# EAGLE design seleprom6-7 (EAGLE 8.3.1)
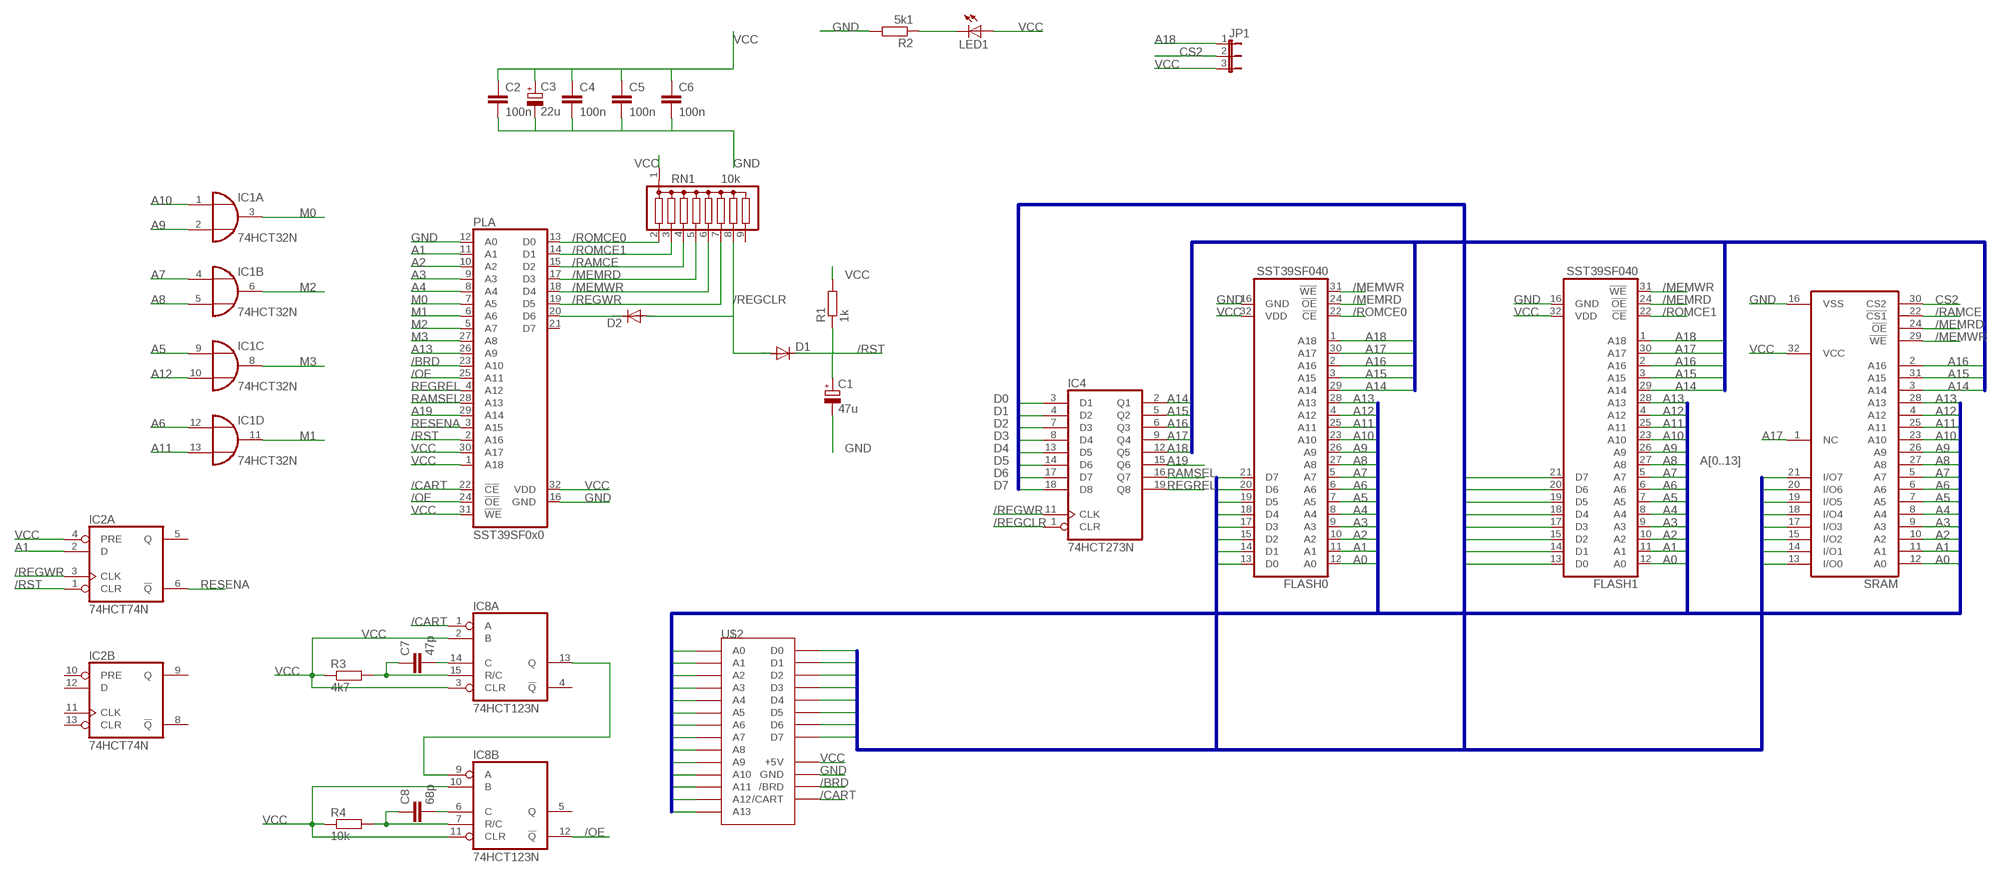
[diagram p0: schematic, sheet 1]

## Parts
C1  47u  CPOL-EUE2.5-5  [E2,5-5]
C2  100n  C-EU025-025X050  [C025-025X050]
C3  22u  CPOL-EUE2-4  [E2-4]
C4  100n  C-EU025-025X050  [C025-025X050]
C5  100n  C-EU025-025X050  [C025-025X050]
C6  100n  C-EU025-025X050  [C025-025X050]
C7  47p  C-EU025-025X050  [C025-025X050]
C8  68p  C-EU025-025X050  [C025-025X050]
D1  DIODE-D-5  [D-5]
D2  DIODE-D-5  [D-5]
FLASH0  SST39SF040  SST39F040  [PLCC-SR32]
FLASH1  SST39SF040  SST39F040  [PLCC-SR32]
IC1  74HCT32N  [DIL14]
IC2  74HCT74N  [DIL14]
IC4  74HCT273N  74273N  [DIL20]
IC8  74HCT123N  74LS123N  [DIL16]
JP1  JP2E  [JP2]
LED1  LED3MM  [LED3MM]
PLA  SST39SF0x0  SST39F040  [PLCC-SR32]
R1  1k  R-EU_0204/7  [0204/7]
R2  5k1  R-EU_0204/7  [0204/7]
R3  4k7  R-EU_0204/7  [0204/7]
R4  10k  R-EU_0204/7  [0204/7]
RN1  10k  G08R  [SIL9]
SRAM  628128P  [DIL32]
U$2  TVC-CARD+  [TVC-CART-CARD]

## Nets
/BRD: PLA.23(A10) U$2.BTM24(/BRD)
/CART: IC8.1(A:A) PLA.22(!CE) U$2.BTM23(/CART)
/MEMRD: FLASH0.24(!OE) FLASH1.24(!OE) PLA.17(D3) RN1.5 SRAM.24(!OE)
/MEMWR: FLASH0.31(!WE) FLASH1.31(!WE) PLA.18(D4) RN1.6 SRAM.29(!WE)
/OE: IC8.12(B:!Q) PLA.24(!OE) PLA.25(A11)
/RAMCE: PLA.15(D2) RN1.4 SRAM.22(!CS1)
/REGCLR: D1.A D2.A IC4.1(CLR) RN1.8
/REGWR: IC2.3(A:CLK) IC4.11(CLK) PLA.19(D5) RN1.7
/ROMCE0: FLASH0.22(!CE) PLA.13(D0) RN1.2
/ROMCE1: FLASH1.22(!CE) PLA.14(D1) RN1.3
/RST: C1.+ D1.C IC2.1(A:CLR) PLA.2(A16) R1.1
A0: FLASH0.12(A0) FLASH1.12(A0) SRAM.12(A0) U$2.TOP25(A0)
A1: FLASH0.11(A1) FLASH1.11(A1) IC2.2(A:D) PLA.11(A1) SRAM.11(A1) U$2.TOP2(A1)
A2: FLASH0.10(A2) FLASH1.10(A2) PLA.10(A2) SRAM.10(A2) U$2.TOP24(A2)
A3: FLASH0.9(A3) FLASH1.9(A3) PLA.9(A3) SRAM.9(A3) U$2.TOP1(A3)
A4: FLASH0.8(A4) FLASH1.8(A4) PLA.8(A4) SRAM.8(A4) U$2.TOP21(A4)
A5: FLASH0.7(A5) FLASH1.7(A5) IC1.9(C:I0) SRAM.7(A5) U$2.TOP14(A5)
A6: FLASH0.6(A6) FLASH1.6(A6) IC1.12(D:I0) SRAM.6(A6) U$2.TOP18(A6)
A7: FLASH0.5(A7) FLASH1.5(A7) IC1.4(B:I0) SRAM.5(A7) U$2.TOP17(A7)
A8: FLASH0.27(A8) FLASH1.27(A8) IC1.5(B:I1) SRAM.27(A8) U$2.TOP15(A8)
A9: FLASH0.26(A9) FLASH1.26(A9) IC1.2(A:I1) SRAM.26(A9) U$2.TOP19(A9)
A10: FLASH0.23(A10) FLASH1.23(A10) IC1.1(A:I0) SRAM.23(A10) U$2.TOP22(A10)
A11: FLASH0.25(A11) FLASH1.25(A11) IC1.13(D:I1) SRAM.25(A11) U$2.TOP20(A11)
A12: FLASH0.4(A12) FLASH1.4(A12) IC1.10(C:I1) SRAM.4(A12) U$2.TOP16(A12)
A13: FLASH0.28(A13) FLASH1.28(A13) PLA.26(A9) SRAM.28(A13) U$2.TOP23(A13)
A14: FLASH0.29(A14) FLASH1.29(A14) IC4.2(Q1) SRAM.3(A14)
A15: FLASH0.3(A15) FLASH1.3(A15) IC4.5(Q2) SRAM.31(A15)
A16: FLASH0.2(A16) FLASH1.2(A16) IC4.6(Q3) SRAM.2(A16)
A17: FLASH0.30(A17) FLASH1.30(A17) IC4.9(Q4) SRAM.1(NC)
A18: FLASH0.1(A18) FLASH1.1(A18) IC4.12(Q5) JP1.1
A19: IC4.15(Q6) PLA.29(A14)
CS2: JP1.2 SRAM.30(CS2)
D0: FLASH0.13(D0) FLASH1.13(D0) IC4.3(D1) SRAM.13(I/O0) U$2.TOP4(D0)
D1: FLASH0.14(D1) FLASH1.14(D1) IC4.4(D2) SRAM.14(I/O1) U$2.TOP5(D1)
D2: FLASH0.15(D2) FLASH1.15(D2) IC4.7(D3) SRAM.15(I/O2) U$2.TOP6(D2)
D3: FLASH0.17(D3) FLASH1.17(D3) IC4.8(D4) SRAM.17(I/O3) U$2.TOP7(D3)
D4: FLASH0.18(D4) FLASH1.18(D4) IC4.13(D5) SRAM.18(I/O4) U$2.TOP8(D4)
D5: FLASH0.19(D5) FLASH1.19(D5) IC4.14(D6) SRAM.19(I/O5) U$2.TOP9(D5)
D6: FLASH0.20(D6) FLASH1.20(D6) IC4.17(D7) SRAM.20(I/O6) U$2.TOP10(D6)
D7: FLASH0.21(D7) FLASH1.21(D7) IC4.18(D8) SRAM.21(I/O7) U$2.TOP3(D7)
GND [power]: C1.- C2.2 C3.- C4.2 C5.2 C6.2 FLASH0.16(GND) FLASH1.16(GND) PLA.12(A0) PLA.16(GND) R2.2 SRAM.16(VSS) U$2.BTM1(GND) U$2.BTM2(GND) U$2.BTM3(GND) U$2.BTM4(GND) U$2.BTM5(GND) U$2.BTM6(GND) U$2.BTM7(GND) U$2.BTM8(GND)
M0: IC1.3(A:O) PLA.7(A5)
M1: IC1.11(D:O) PLA.6(A6)
M2: IC1.6(B:O) PLA.5(A7)
M3: IC1.8(C:O) PLA.27(A8)
N$1: D2.C PLA.20(D6)
N$3: LED1.K(C) R2.1
N$6: IC8.9(B:A) IC8.13(A:Q)
N$7: C7.2 IC8.14(A:C)
N$8: C8.2 IC8.6(B:C)
N$9: C8.1 IC8.7(B:R/C) R4.2
N$11: C7.1 IC8.15(A:R/C) R3.2
RAMSEL: IC4.16(Q7) PLA.28(A13)
REGREL: IC4.19(Q8) PLA.4(A12)
RESENA: IC2.6(A:!Q) PLA.3(A15)
VCC [power]: C2.1 C3.+ C4.1 C5.1 C6.1 FLASH0.32(VDD) FLASH1.32(VDD) IC2.4(A:PRE) IC8.2(A:B) IC8.3(A:CLR) IC8.10(B:B) IC8.11(B:CLR) JP1.3 LED1.A PLA.1(A18) PLA.30(A17) PLA.31(!WE) PLA.32(VDD) R1.2 R3.1 R4.1 RN1.1 SRAM.32(VCC) U$2.BTM10(+5V) U$2.BTM11(+5V) U$2.BTM12(+5V) U$2.BTM13(+5V) U$2.BTM14(+5V) U$2.BTM15(+5V) U$2.BTM16(+5V) U$2.BTM17(+5V)
Unconnected: IC2.5(A:Q) IC2.8(B:!Q) IC2.9(B:Q) IC2.10(B:PRE) IC2.11(B:CLK) IC2.12(B:D) IC2.13(B:CLR) IC8.4(A:!Q) IC8.5(B:Q) PLA.21(D7) RN1.9

## Buses
A[0..13]
A[14..18]
D[0..7]

## Power pins joined to a net without a drawn wire
GND: IC1.7(P:GND) IC2.7(P:GND) IC4.10(GND) IC8.8(P:GND)
VCC: IC1.14(P:VCC) IC2.14(P:VCC) IC4.20(VCC) IC8.16(P:VCC)

## Library data of the parts
C1 C3 = rcl:CPOL-EU: POLARIZED CAPACITOR, European symbol
C2 C4-C8 = rcl:C-EU: CAPACITOR, European symbol
D1 D2 = diode:DIODE-: DIODE
FLASH0 FLASH1 PLA = sst39f040:SST39F040
IC1 = 74xx-eu:74*32: Quad 2-input OR gate
IC2 = 74xx-eu:74*74: Dual D type positive edge triggered FLIP FLOP, preset and clear
IC4 = 74xx-eu:74*273: Octal D type FLIP FLOP, clear
IC8 = 74xx-eu:74*123: Retriggerable monostable MULTIVIBRATOR
JP1 = jumper:JP2E: JUMPER
LED1 = led:LED: LED OSRAM: - CHIPLED LG R971, LG N971, LY N971, LG Q971, LY Q971, LO R971, LY R971 LH N974, LH R974 LS Q976, LO Q976, LY Q976 LO Q996 - Hyper CHIPLED LW Q18S LB Q993, LB Q99A, LB R99A - SideLED LS A670, LO A670, LY A670, LG A670, LP A670 LB A673, LV A673, LT A673, LW A673 LH A674 LY A675 LS A676, LA A676, LO A676, LY A676, LW A676 LS A679, LY A679, LG A679 - Hyper Micro SIDELED® LS Y876, LA Y876, LO Y876, LY Y876 LT Y87S - SmartLED LW L88C, LW L88S LB L89C, LB L89S, LG L890 LS L89K, LO L89K, LY L89K LS L896, LA L896, LO L896, LY L896 - TOPLED LS T670, LO T670, LY T670, LG T670, LP T670 LSG T670, LSP T670, LSY T670, LOP T670, LYG T670 LG T671, LOG T671, LSG T671 LB T673, LV T673, LT T673, LW T673 LH T674 LS T676, LA T676, LO T676, LY T676, LB T676, LH T676, LSB T676, LW T676 LB T67C, LV T67C, LT T67C, LS T67K, LO T67K, LY T67K, LW E67C LS E67B, LA E67B, LO E67B, LY E67B, LB E67C, LV E67C, LT E67C LW T67C LS T679, LY T679, LG T679 LS T770, LO T770, LY T770, LG T770, LP T770 LB T773, LV T773, LT T773, LW T773 LH T774 LS E675, LA E675, LY E675, LS T675 LS T776, LA T776, LO T776, LY T776, LB T776 LHGB T686 LT T68C, LB T68C - Hyper Mini TOPLED® LB M676 - Mini TOPLED Santana® LG M470 LS M47K, LO M47K, LY M47K Source: http://www.osram.convergy.de LUXEON: - LUMILED® LXK2-PW12-R00, LXK2-PW12-S00, LXK2-PW14-U00, LXK2-PW14-V00 LXK2-PM12-R00, LXK2-PM12-S00, LXK2-PM14-U00 LXK2-PE12-Q00, LXK2-PE12-R00, LXK2-PE12-S00, LXK2-PE14-T00, LXK2-PE14-U00 LXK2-PB12-K00, LXK2-PB12-L00, LXK2-PB12-M00, LXK2-PB14-N00, LXK2-PB14-P00, LXK2-PB14-Q00 LXK2-PR12-L00, LXK2-PR12-M00, LXK2-PR14-Q00, LXK2-PR14-R00 LXK2-PD12-Q00, LXK2-PD12-R00, LXK2-PD12-S00 LXK2-PH12-R00, LXK2-PH12-S00 LXK2-PL12-P00, LXK2-PL12-Q00, LXK2-PL12-R00 Source: www.luxeon.com KINGBRIGHT: KA-3528ASYC Source: www.kingbright.com
R1-R4 = rcl:R-EU_: RESISTOR, European symbol
RN1 = resistor-sil:G08R: SIL RESISTOR; OC_FARNELL: unknown; OC_NEWARK: unknown
SRAM = memory-hitachi:628128P: MEMORY; OC_FARNELL: unknown; OC_NEWARK: unknown
U$2 = tvc-cart:TVC-CARD+

## Net classes
0 default: width 0.254 mm
1 power: width 0.356 mm

## Board
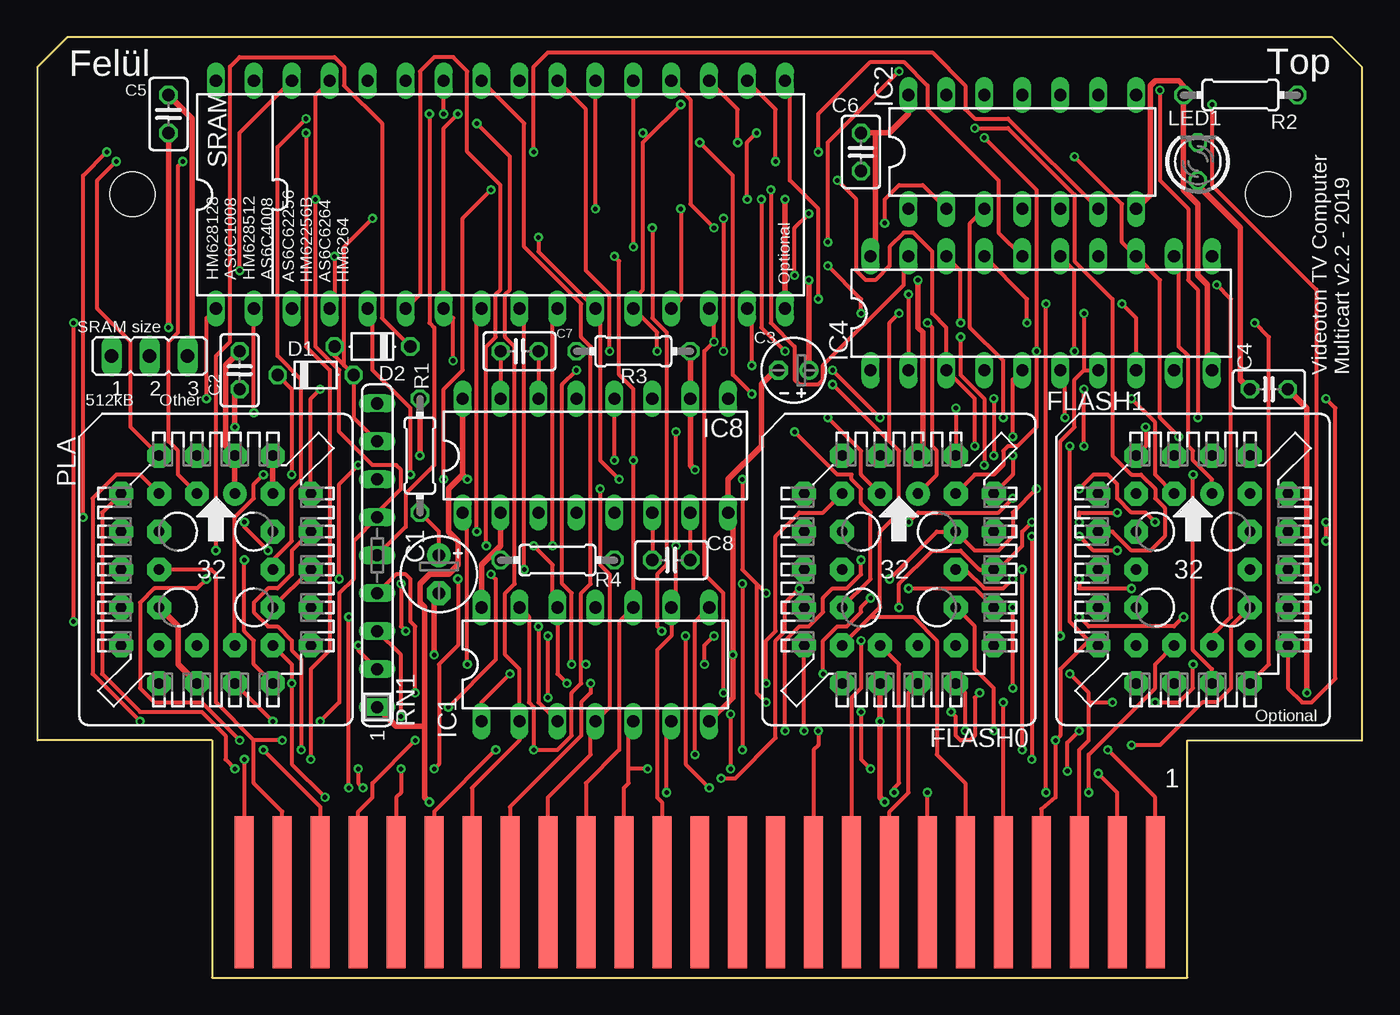
[diagram p1: board, top side]
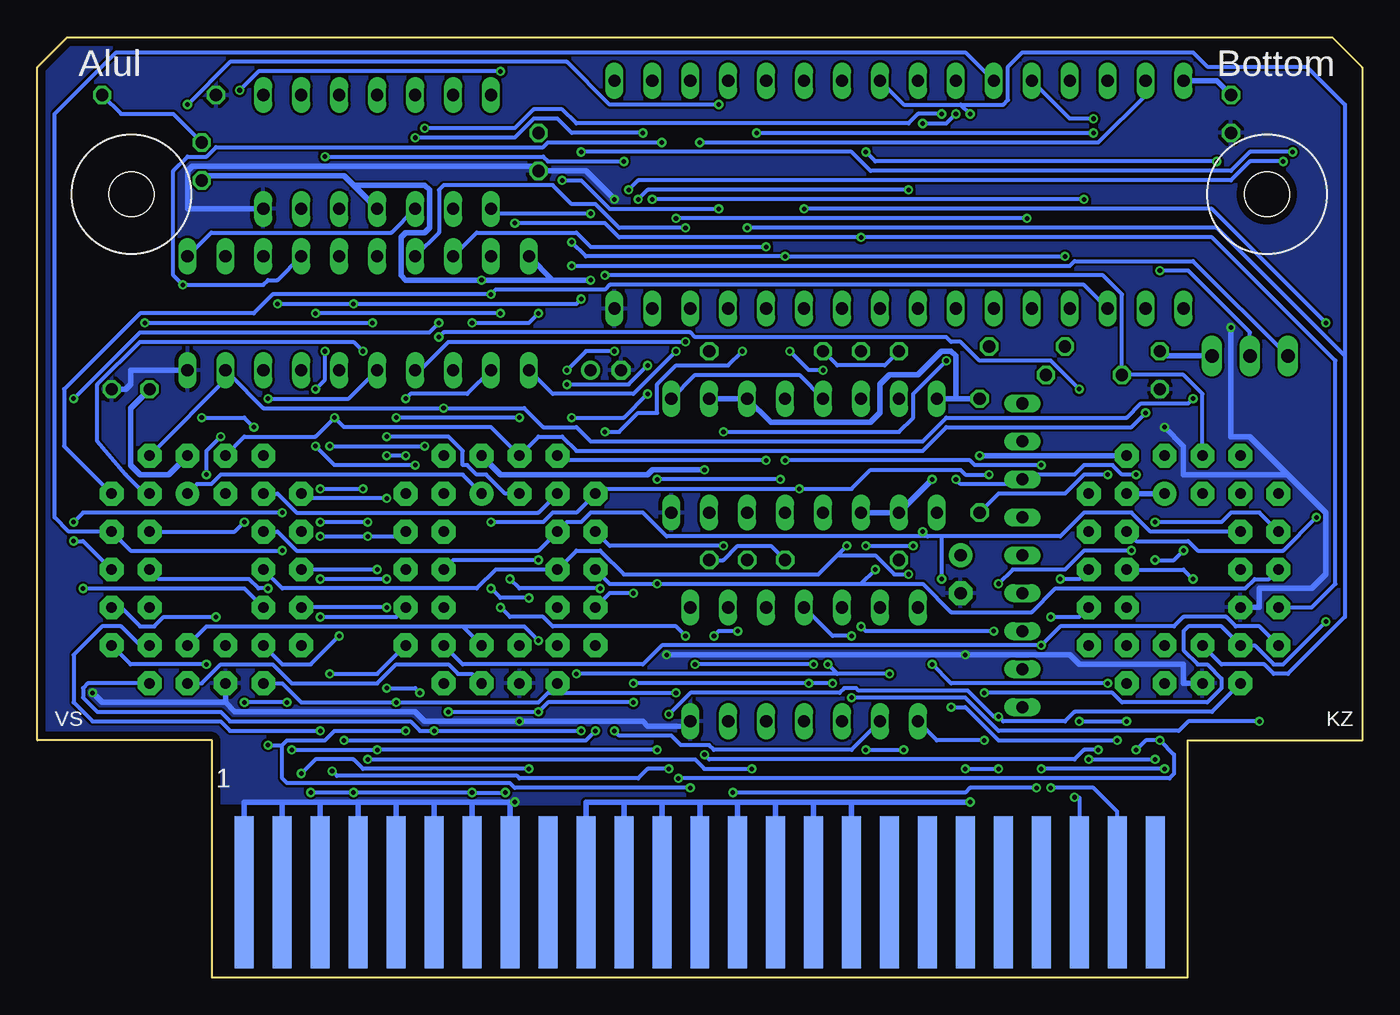
[diagram p2: board, bottom side, seen from below]

Size 88.68 x 62.91 mm. Coordinates in mm from the lower left corner, seen from the top.
Copper layers (1*16): Top 0.035mm / dielectric 1.6mm / Bottom 0.035mm
Design rules "Elecrow_2-layer_PCB_eagle_rule": minimum track width 6mil, minimum drill 12mil, track to track 6mil, track to pad 6mil, pad to pad 6mil, via to via 8mil, smd to smd 0mil, copper to edge 20mil, drill to drill 10mil, minimum pad ring 6mil, minimum via ring 6mil, stop-mask expansion 0mil, vias tented up to drill 100mil, thermal gap 10mil

### Footprints (pad centres in the part's own frame; a part is rotated, then mirrored left to right if it is on the bottom)
E2,5-5 = drill 0.813 pad 1.6: + -1.27,0 | drill 0.813 pad 1.6 octagon: - 1.27,0
C025-025X050 = drill 0.813 octagon: 1 -1.27,0; 2 1.27,0
E2-4 = drill 0.813 pad 1.27: + -1.016,0 | drill 0.813 pad 1.27 octagon: - 1.016,0
D-5 = drill 0.813 octagon: A 2.54,0; C -2.54,0
PLCC-SR32 = drill 0.7 pad 1.6: 1 1.27,5.08 | drill 0.7 pad 1.6 octagon: 2 -1.27,7.62; 3 -1.27,5.08; 4 -3.81,7.62; 5 -6.35,5.08; 6 -3.81,5.08; 7 -6.35,2.54; 8 -3.81,2.54; 9 -6.35,0; 10 -3.81,0; 11 -6.35,-2.54; 12 -3.81,-2.54; 13 -6.35,-5.08; 14 -3.81,-7.62; 15 -3.81,-5.08; 16 -1.27,-7.62; 17 -1.27,-5.08; 18 1.27,-7.62; 19 1.27,-5.08; 20 3.81,-7.62; 21 6.35,-5.08; 22 3.81,-5.08; 23 6.35,-2.54; 24 3.81,-2.54; 25 6.35,0; 26 3.81,0; 27 6.35,2.54; 28 3.81,2.54; 29 6.35,5.08; 30 3.81,7.62; 31 3.81,5.08; 32 1.27,7.62
DIL14 = drill 0.813 long: 1 -7.62,-3.81; 2 -5.08,-3.81; 3 -2.54,-3.81; 4 0,-3.81; 5 2.54,-3.81; 6 5.08,-3.81; 7 7.62,-3.81; 8 7.62,3.81; 9 5.08,3.81; 10 2.54,3.81; 11 0,3.81; 12 -2.54,3.81; 13 -5.08,3.81; 14 -7.62,3.81
DIL20 = drill 0.813 long: 1 -11.43,-3.81; 2 -8.89,-3.81; 3 -6.35,-3.81; 4 -3.81,-3.81; 5 -1.27,-3.81; 6 1.27,-3.81; 7 3.81,-3.81; 8 6.35,-3.81; 9 8.89,-3.81; 10 11.43,-3.81; 11 11.43,3.81; 12 8.89,3.81; 13 6.35,3.81; 14 3.81,3.81; 15 1.27,3.81; 16 -1.27,3.81; 17 -3.81,3.81; 18 -6.35,3.81; 19 -8.89,3.81; 20 -11.43,3.81
DIL16 = drill 0.813 long: 1 -8.89,-3.81; 2 -6.35,-3.81; 3 -3.81,-3.81; 4 -1.27,-3.81; 5 1.27,-3.81; 6 3.81,-3.81; 7 6.35,-3.81; 8 8.89,-3.81; 9 8.89,3.81; 10 6.35,3.81; 11 3.81,3.81; 12 1.27,3.81; 13 -1.27,3.81; 14 -3.81,3.81; 15 -6.35,3.81; 16 -8.89,3.81
JP2 = drill 0.914 long: 1 -2.54,0; 2 0,0; 3 2.54,0
LED3MM = drill 0.813 octagon: A -1.27,0; K 1.27,0
0204/7 = drill 0.813 octagon: 1 -3.81,0; 2 3.81,0
SIL9 = drill 0.813 long: 1 -10.16,0; 2 -7.62,0; 3 -5.08,0; 4 -2.54,0; 5 0,0; 6 2.54,0; 7 5.08,0; 8 7.62,0; 9 10.16,0
DIL32 = drill 0.813 long: 1 -19.05,-7.62; 2 -16.51,-7.62; 3 -13.97,-7.62; 4 -11.43,-7.62; 5 -8.89,-7.62; 6 -6.35,-7.62; 7 -3.81,-7.62; 8 -1.27,-7.62; 9 1.27,-7.62; 10 3.81,-7.62; 11 6.35,-7.62; 12 8.89,-7.62; 13 11.43,-7.62; 14 13.97,-7.62; 15 16.51,-7.62; 16 19.05,-7.62; 17 19.05,7.62; 18 16.51,7.62; 19 13.97,7.62; 20 11.43,7.62; 21 8.89,7.62; 22 6.35,7.62; 23 3.81,7.62; 24 1.27,7.62; 25 -1.27,7.62; 26 -3.81,7.62; 27 -6.35,7.62; 28 -8.89,7.62; 29 -11.43,7.62; 30 -13.97,7.62; 31 -16.51,7.62; 32 -19.05,7.62
TVC-CART-CARD = smd 1.27 x 10.16 bottom: BTM1 29.21,-6.35; BTM2 26.67,-6.35; BTM3 24.13,-6.35; BTM4 21.59,-6.35; BTM5 19.05,-6.35; BTM6 16.51,-6.35; BTM7 13.97,-6.35; BTM8 11.43,-6.35; BTM9 8.89,-6.35; BTM10 6.35,-6.35; BTM11 3.81,-6.35; BTM12 1.27,-6.35; BTM13 -1.27,-6.35; BTM14 -3.81,-6.35; BTM15 -6.35,-6.35; BTM16 -8.89,-6.35; BTM17 -11.43,-6.35; BTM18 -13.97,-6.35; BTM19 -16.51,-6.35; BTM20 -19.05,-6.35; BTM21 -21.59,-6.35; BTM22 -24.13,-6.35; BTM23 -26.67,-6.35; BTM24 -29.21,-6.35; BTM25 -31.75,-6.35 | smd 1.27 x 10.16: TOP1 29.21,-6.35; TOP2 26.67,-6.35; TOP3 24.13,-6.35; TOP4 21.59,-6.35; TOP5 19.05,-6.35; TOP6 16.51,-6.35; TOP7 13.97,-6.35; TOP8 11.43,-6.35; TOP9 8.89,-6.35; TOP10 6.35,-6.35; TOP11 3.81,-6.35; TOP12 1.27,-6.35; TOP13 -1.27,-6.35; TOP14 -3.81,-6.35; TOP15 -6.35,-6.35; TOP16 -8.89,-6.35; TOP17 -11.43,-6.35; TOP18 -13.97,-6.35; TOP19 -16.51,-6.35; TOP20 -19.05,-6.35; TOP21 -21.59,-6.35; TOP22 -24.13,-6.35; TOP23 -26.67,-6.35; TOP24 -29.21,-6.35; TOP25 -31.75,-6.35 | hole 3: -39.24,40.35; 36.76,40.35

### Placement (x,y rotation side)
C1  26.88,26.99 270 top
C2  13.54,40.64 270 top
C3  50.63,40.64 180 top
C4  82.44,39.37 0 top
C5  8.78,57.78 270 top
C6  55.13,55.25 270 top
C7  32.27,41.91 0 top
C8  42.43,27.94 180 top
D1  18.62,40.32 0 top
D2  22.43,42.23 180 top
FLASH0  57.67,27.3 0 top
FLASH1  77.36,27.3 0 top
IC1  37.35,20.95 0 top
IC2  65.93,55.25 0 top
IC4  67.2,44.45 0 top
IC8  37.35,34.92 0 top
JP1  7.51,41.59 0 top
LED1  77.68,54.61 90 top
PLA  11.95,27.3 0 top
R1  25.61,34.92 90 top
R2  80.53,59.05 180 top
R3  39.89,41.91 180 top
R4  34.81,27.94 0 top
RN1  22.75,28.26 90 top
SRAM  31,52.39 0 top
U$2  45.61,12.06 0 top

### Tracks (layer width: path | path; a pad name or v marks a point on that pad's centre or on a via)
/BRD  (via drill 0.3)
  Top 0.254: v20.84,12.7 v20.84,24.13
  Bottom 0.254: PLA.23 18.94,24.13 v20.84,24.13 | v20.84,12.7 17.99,12.7 16.4,11.11 U$2.BTM24
/CART  (via drill 0.3)
  Top 0.254: IC8.1 28.78,30.8 v28.78,20.95 | PLA.22 17.03,20.95 v17.03,19.68 17.03,14.29 v19.26,12.06
  Bottom 0.254: v28.78,20.95 27.51,19.68 v17.03,19.68 | U$2.BTM23 18.94,12.06 v19.26,12.06
/MEMRD  (via drill 0.3)
  Top 0.254: FLASH0.24 62.75,23.5 62.75,20.64 64.02,19.37 v64.02,16.51 | v73.23,15.56 75.14,15.56 77.99,18.41 78.95,18.41 79.9,19.37 79.9,23.5 FLASH1.24 | RN1.5 24.65,30.16 24.65,32.39 26.56,34.29 26.56,43.5 26.24,43.81 v26.24,57.78 | v44.97,12.7 43.39,14.29 v43.39,22.86 | v41.8,23.18 41.48,23.5 41.48,26.99 42.12,27.62 42.12,43.18 41.16,44.13 v41.16,50.17
  Bottom 0.254: v73.23,15.56 72.28,15.56 | 72.28,15.56 71.96,15.88 69.42,15.88 68.79,16.51 v64.02,16.51 | 26.88,58.42 v26.24,57.78 | 26.88,58.42 30.69,58.42 SRAM.24 | PLA.17 9.41,20.95 6.56,20.95 5.92,20.32 4.97,20.32 1.16,24.13 1.16,41.59 | 1.16,41.59 1.16,58.42 3.7,60.96 10.37,60.96 11.32,61.91 22.75,61.91 23.7,60.96 23.7,58.74 24.02,58.42 26.88,58.42 | 72.28,15.56 72.28,13.34 71.96,13.02 57.04,13.02 56.72,12.7 v44.97,12.7 | v43.39,22.86 43.07,23.18 v41.8,23.18 | v41.16,50.17 9.73,50.17 1.16,41.59
/MEMWR  (via drill 0.3)
  Top 0.254: FLASH0.31 62.75,33.66 64.02,33.66 64.66,34.29 64.66,35.24 64.98,35.56 65.61,35.56 66.88,36.83 v66.88,41.91 66.88,52.7 v63.39,56.2 | SRAM.29 18.62,59.05 v18.62,52.07 18.62,42.23 20.21,40.64 20.21,36.51 22.43,34.29 24.02,34.29 24.34,33.97 24.34,32.7 22.75,31.11 RN1.6 21.16,29.21 21.16,26.67 20.21,25.72 20.21,18.41 v18.94,17.14 | v15.76,17.14 PLA.18 | v48.15,56.52 47.51,55.88 v47.51,52.07
  Bottom 0.254: v66.88,41.91 67.52,42.55 81.8,42.55 84.66,39.69 84.66,35.88 82.76,33.66 81.49,32.39 FLASH1.31 | v18.94,17.14 v15.76,17.14 | v63.39,56.2 56.72,56.2 55.45,57.47 53.86,57.47 52.91,56.52 v48.15,56.52 | v18.62,52.07 v47.51,52.07
/OE  (via drill 0.3)
  Top 0.254: v38.62,34.61 IC8.12 | v21.48,34.29 20.21,33.02 v20.21,26.67 | PLA.25 PLA.24
  Bottom 0.254: v38.62,34.61 26.24,34.61 25.92,34.29 v21.48,34.29 | v20.21,26.67 18.94,26.67 PLA.25
/RAMCE  (via drill 0.3)
  Top 0.254: RN1.4 24.02,26.99 24.65,26.99 24.97,26.67 24.97,23.81 25.29,23.5 v25.29,19.05 | v37.35,51.44 SRAM.22 | v2.43,23.81 v2.43,43.81
  Bottom 0.254: v25.29,19.05 16.72,19.05 16.08,18.41 10.37,18.41 9.41,19.37 9.41,20 10.37,20.95 11,20.95 11.95,21.91 11.95,23.18 11.64,23.5 9.41,23.5 PLA.15 7.19,22.22 5.92,20.95 5.29,20.95 v2.43,23.81 | v37.35,51.44 10.05,51.44 v2.43,43.81
/REGCLR  (via drill 0.3)
  Top 0.254: 20.53,40.96 19.89,41.59 D2.A | 20.53,40.96 D1.A 21.16,37.47 RN1.8 | v45.93,50.8 v45.93,41.91 | v22.43,50.8 20.53,48.89 20.53,40.96
  Bottom 0.254: IC4.1 54.18,39.05 48.78,39.05 v45.93,41.91 | v22.43,50.8 v45.93,50.8
/REGWR  (via drill 0.3)
  Top 0.254: v15.13,33.66 14.49,33.02 14.49,32.07 13.22,30.8 PLA.19 | IC2.3 62.44,50.48 62.44,43.5 64.66,41.28 v64.66,37.47 | v53.23,40.64 v56.4,37.47 | v50.05,41.91 48.47,43.5 v48.47,52.07 | v30.37,52.7 28.46,50.8 28.46,40.64 27.19,39.37 v27.19,33.34
  Bottom 0.254: IC2.3 64.98,49.85 77.04,49.85 IC4.11 | v15.13,33.66 16.08,33.66 16.72,34.29 18.62,34.29 19.26,33.66 22.43,33.66 RN1.7 23.07,33.02 26.88,33.02 v27.19,33.34 | v56.4,37.47 v64.66,37.47 | v53.23,40.64 51.96,41.91 v50.05,41.91 | v48.47,52.07 47.83,52.7 v30.37,52.7
/ROMCE0  (via drill 0.3)
  Top 0.254: RN1.2 21.48,21.91 v21.48,22.22
  Bottom 0.254: PLA.13 6.87,23.5 8.46,23.5 9.1,24.13 11.95,24.13 12.59,23.5 20.21,23.5 v21.48,22.22 46.88,22.22 48.15,20.95 60.21,20.95 FLASH0.22
/ROMCE1  (via drill 0.3)
  Top 0.254: RN1.3 24.34,21.59 v24.34,17.46 | v46.4,17.62 v46.4,13.97 | v68.95,13.81 68.95,15.72 v69.74,16.51
  Bottom 0.254: PLA.14 10.05,17.78 19.26,17.78 19.89,17.14 24.02,17.14 v24.34,17.46 24.65,17.46 26.4,19.21 33.7,19.21 33.86,19.37 34.66,19.37 34.97,19.05 44.97,19.05 v46.4,17.62 | FLASH1.22 81.8,22.22 83.07,23.5 84.34,23.5 86.25,21.59 86.25,18.41 84.98,17.14 76.41,17.14 75.77,16.51 v69.74,16.51 | v46.4,13.97 47.83,13.97 48.47,13.34 56.4,13.34 56.56,13.49 68.63,13.49 v68.95,13.81
/RST  (via drill 0.3)
  Top 0.254: R1.1 26.88,29.85 C1.+ | v51.64,51.12 50.69,50.17 v50.69,46.99 | v17.03,33.66 17.03,39.37 D1.C
  Bottom 0.254: PLA.2 10.68,39.05 11.95,40.32 D1.C 16.08,45.72 17.35,46.99 v50.69,46.99 | IC2.1 57.99,51.12 v51.64,51.12 | R1.1 24.34,32.39 19.89,32.39 18.62,33.66 v17.03,33.66
A0  (via drill 0.3)
  Top 0.254: v41.48,41.91 41.48,43.18 SRAM.12 39.89,45.4 40.53,46.04 40.53,55.88 40.85,56.2 | v50.69,36.51 53.55,33.66 54.5,33.66 54.5,33.34 55.13,32.7 55.13,31.75 55.77,31.11 55.77,26.67 FLASH0.12 | v85.61,26.04 85.61,46.04 78.63,53.02 v78.63,58.42 | 40.85,56.2 v43.07,58.42 | v13.86,14.61 U$2.TOP25 | v18.3,14.61 18.3,20.64 19.57,21.91 19.57,40.64 17.99,42.23 v17.99,56.52 | 40.85,56.2 v40.53,56.52
  Bottom 0.254: v41.48,41.91 42.43,40.96 45.93,40.96 47.2,39.69 47.2,37.78 48.47,37.78 49.74,36.51 v50.69,36.51 | FLASH1.12 74.82,26.04 v85.61,26.04 | v78.63,58.42 75.77,61.28 53.23,61.28 50.37,58.42 v43.07,58.42 | v18.3,14.61 v13.86,14.61 | v40.53,56.52 v17.99,56.52
A1  (via drill 0.3)
  Top 0.254: v65.29,19.37 v65.29,24.77 | v71.01,13.65 72.28,12.38 U$2.TOP2 | v33.54,49.53 33.54,48.58 SRAM.11 37.67,44.45 37.67,34.61 v38.94,33.34 | IC2.2 59.26,53.02 57.67,53.02 56.72,52.07 v56.72,50.48 | 48.15,26.35 47.2,27.3 v47.2,33.34 | 48.15,26.35 v48.78,25.72 | v55.77,13.97 55.13,14.61 v55.13,17.78 | v48.78,18.41 48.15,19.05 48.15,26.35 | v63.07,19.05 62.75,18.73 62.75,16.19 62.44,15.88 61.8,15.88 61.48,16.19 61.48,17.46 v61.17,17.78
  Bottom 0.254: v65.29,24.77 FLASH1.11 | v71.01,13.65 70.06,14.61 67.52,14.61 66.88,13.97 v55.77,13.97 | PLA.11 3.38,24.77 1.79,26.35 1.79,41.28 10.05,49.53 v33.54,49.53 49.74,49.53 50.69,50.48 v56.72,50.48 | FLASH0.11 50.37,25.72 v48.78,25.72 | v38.94,33.34 v47.2,33.34 | v48.78,18.41 54.5,18.41 v55.13,17.78 v61.17,17.78 | v65.29,19.37 63.39,19.37 v63.07,19.05
A2  (via drill 0.3)
  Top 0.254: PLA.10 11.64,27.3 11.95,26.99 11.95,18.41 14.49,15.88 | 14.49,15.88 14.49,13.02 16.4,11.11 U$2.TOP24 | SRAM.10 34.5,44.45 v34.5,28.89 | v16.4,15.88 14.49,15.88 | v27.51,18.1 30.69,21.27 30.69,26.67 v30.37,26.99
  Bottom 0.254: 35.13,28.26 36.4,26.99 49.42,26.99 51.01,28.57 52.59,28.57 FLASH0.10 57.99,27.3 59.26,26.04 72.28,26.04 FLASH1.10 | 35.13,28.26 v34.5,28.89 | v16.4,15.88 24.34,15.88 26.56,18.1 v27.51,18.1 | v30.37,26.99 31.32,26.99 32.59,28.26 35.13,28.26
A3  (via drill 0.3)
  Top 0.254: v65.93,15.24 v65.93,27.3 | v71.64,15.24 74.82,12.06 U$2.TOP1 | SRAM.9 32.59,44.45 v32.59,27.3 | v47.2,26.35 v47.2,15.24
  Bottom 0.254: v65.93,27.3 FLASH1.9 | v71.64,15.24 v65.93,15.24 v47.2,15.24 | 33.54,26.35 v32.59,27.3 | 33.54,26.35 v47.2,26.35 50.37,26.35 FLASH0.9 | PLA.9 6.24,26.67 7.19,26.67 7.83,26.04 20.53,26.04 22.11,24.45 27.51,24.45 29.42,26.35 33.54,26.35
A4  (via drill 0.3)
  Top 0.254: SRAM.8 29.42,44.45 v29.42,29.85 | U$2.TOP21 24.34,6.03 24.02,9.84 24.02,12.06 24.34,12.38 v24.34,13.97 | v26.56,13.97 26.88,14.29 26.88,20.95 28.15,22.22 v28.15,26.67
  Bottom 0.254: FLASH1.8 72.6,29.85 71.33,28.57 55.13,28.57 FLASH0.8 53.23,30.48 52.28,30.48 51.64,31.11 48.15,31.11 46.56,29.53 29.1,29.53 | 29.1,29.53 v29.42,29.85 | 28.15,29.53 20.21,29.53 18.62,31.11 15.45,31.11 14.18,29.85 PLA.8 | 28.15,29.53 29.1,29.53 | v26.56,13.97 v24.34,13.97 | 28.15,29.53 v28.15,26.67
A5  (via drill 0.3)
  Top 0.254: v27.83,41.28 27.83,44.13 SRAM.7 27.19,56.83 v28.15,57.78 | v42.75,36.51 v42.75,28.89 42.75,25.08 IC1.9 42.43,22.86 41.48,21.91 41.48,12.06 41.8,11.75 41.8,10.48 41.48,6.03 U$2.TOP14 | FLASH1.7 71.96,29.85 73.23,28.57 74.5,28.57 75.45,29.53 75.45,31.43 74.82,32.07 74.82,32.7 73.87,33.66 73.23,33.66 71.96,34.92 71.96,45.4 69.42,47.94 69.42,52.39 64.98,56.83 v62.75,56.83
  Bottom 0.254: v27.83,41.28 30.05,39.05 30.05,37.47 31,36.51 v42.75,36.51 | FLASH0.7 50.37,28.89 v42.75,28.89 | v62.75,56.83 56.72,56.83 55.45,58.1 53.55,58.1 52.59,57.15 30.37,57.15 29.73,57.78 v28.15,57.78
A6  (via drill 0.3)
  Top 0.254: SRAM.6 25.61,45.72 25.61,60.64 26.56,61.59 27.83,61.59 28.78,60.64 28.78,55.25 31,53.02 31,46.04 30.69,45.72 30.69,42.86 30.05,42.23 v30.05,28.89 | v33.23,28.89 34.5,27.62 34.5,25.08 IC1.12 34.81,20.32 v35.45,19.68 | FLASH0.6 52.59,31.11 51.01,31.11 49.42,29.53 49.42,23.18 48.78,22.54 v48.78,19.68 | U$2.TOP18 31.96,6.03 31.64,9.84 31.64,11.43 36.4,16.19 36.4,18.41 37.04,19.05 v37.04,19.68
  Bottom 0.254: FLASH0.6 55.13,31.11 71.33,31.11 72.6,32.39 FLASH1.6 | v33.23,28.89 v30.05,28.89 | v35.45,19.68 v37.04,19.68 v48.78,19.68
A7  (via drill 0.3)
  Top 0.254: U$2.TOP17 34.18,12.06 37.04,14.92 37.04,16.83 IC1.4 38.31,18.1 38.31,26.99 37.67,27.62 v37.67,32.7 | SRAM.5 22.43,44.45 22.43,40.64 24.97,38.1 v24.97,33.66 | v65.29,32.07 64.34,31.11 58.94,31.11 v58.31,30.48
  Bottom 0.254: v24.97,33.66 26.56,33.66 26.88,33.97 32.91,33.97 34.18,32.7 v37.67,32.7 51.01,32.7 FLASH0.5 52.59,31.11 54.18,31.11 54.82,30.48 v58.31,30.48 | FLASH1.5 70.69,32.07 v65.29,32.07
A8  (via drill 0.3)
  Top 0.254: IC1.5 39.58,16.83 39.58,13.97 | 39.58,13.97 39.58,13.02 39.26,12.7 39.26,9.84 39.58,6.03 U$2.TOP15 | v69.74,29.53 70.69,28.57 v72.28,28.57 | v40.85,13.97 39.58,13.97 | v66.56,29.53 v66.56,14.61
  Bottom 0.254: SRAM.27 26.56,61.91 83.39,61.91 87.52,57.78 87.52,30.8 86.57,29.85 FLASH1.27 82.44,28.57 v72.28,28.57 | FLASH0.27 64.34,29.53 v66.56,29.53 v69.74,29.53 | v40.85,13.97 44.02,13.97 44.66,14.61 v66.56,14.61
A9  (via drill 0.3)
  Top 0.254: v27.19,57.78 SRAM.26 | v29.42,57.15 31.64,54.93 31.64,46.04 31.32,45.72 31.32,42.86 31.96,42.23 31.96,26.35 31.32,25.72 31.32,21.59 32.27,20.64 IC1.2 32.27,15.88 29.1,12.7 29.1,9.84 29.42,9.52 29.42,6.03 U$2.TOP19 | v55.13,27.94 55.13,26.99 54.18,26.04 53.23,26.04 52.59,25.4 52.59,24.45 51.64,23.5 51.01,23.5 50.05,22.54 v50.05,16.51 | v73.23,26.04 69.74,26.04 v69.74,26.67 | v65.29,26.67 64.66,26.04 63.39,26.04 62.12,27.3 FLASH0.26
  Bottom 0.254: v27.19,57.78 27.83,57.15 v29.42,57.15 | FLASH0.26 60.85,27.94 v55.13,27.94 | v50.05,16.51 49.74,16.19 46.24,16.19 45.61,15.56 43.7,15.56 43.39,15.24 34.18,15.24 IC1.2 | FLASH1.26 80.53,26.67 74.5,26.67 73.87,26.04 v73.23,26.04 | v65.29,26.67 v69.74,26.67
A10  (via drill 0.3)
  Top 0.254: v69.74,24.13 70.37,23.5 76.09,23.5 v76.72,24.13 | v25.29,15.88 22.43,13.02 22.43,12.06 21.48,11.11 U$2.TOP22 | SRAM.23 36.72,58.1 36.72,47.31 38.31,45.72 v38.31,41.91 | v36.08,40.64 35.13,39.69 35.13,26.35 35.77,25.72 v35.77,20.95 | v31.64,20.32 29.73,18.41 IC1.1 | FLASH0.23 62.75,26.04 v58.31,26.04 | v55.77,25.4 55.13,24.77 55.13,24.45 54.18,23.5 53.55,23.5 52.59,22.54 v52.59,20.32
  Bottom 0.254: FLASH0.23 64.66,24.13 v69.74,24.13 | v76.72,24.13 80.22,24.13 80.85,23.5 81.8,23.5 83.07,24.77 FLASH1.23 | IC1.1 28.46,15.88 v25.29,15.88 | v36.08,40.64 37.04,40.64 v38.31,41.91 | 35.13,20.32 v35.77,20.95 | v31.64,20.32 35.13,20.32 | v58.31,26.04 57.67,25.4 v55.77,25.4 | 35.13,20.32 v52.59,20.32
A11  (via drill 0.3)
  Top 0.254: SRAM.25 32.59,57.15 32.59,48.89 36.4,45.08 36.4,42.86 37.04,42.23 37.04,26.35 36.4,25.72 36.4,20.95 | 36.4,20.95 36.4,19.68 35.77,19.05 35.77,16.19 34.81,15.24 v33.23,15.24 33.23,18.1 32.91,18.41 32.91,24.13 IC1.13 | v57.67,24.77 57.67,26.35 59.9,28.57 61.8,28.57 63.07,27.3 FLASH0.25 64.34,27.3 65.93,28.89 65.93,29.85 v66.56,30.48 | v45.29,22.86 44.66,22.22 v44.66,20.95 | 36.4,20.95 v36.72,20.95 | v86.25,30.48 v86.25,29.21 | v72.28,31.11 69.74,31.11 v69.74,30.48 | U$2.TOP20 26.88,6.03 26.56,8.89 26.56,11.11 v30.69,15.24
  Bottom 0.254: v57.67,24.77 57.04,24.13 54.82,24.13 54.18,23.5 45.93,23.5 v45.29,22.86 | v36.72,20.95 v44.66,20.95 | FLASH1.25 85.61,29.21 v86.25,29.21 | v86.25,30.48 85.61,31.11 v72.28,31.11 | v66.56,30.48 v69.74,30.48 | v33.23,15.24 v30.69,15.24
A12  (via drill 0.3)
  Top 0.254: SRAM.4 19.89,45.08 v19.89,48.26 | v38.62,48.26 38.94,47.94 38.94,40.32 39.89,39.37 v39.89,34.61 IC1.10 38.94,23.81 38.94,15.24 36.72,13.02 36.72,9.68 37.04,6.03 U$2.TOP16 | FLASH1.4 74.18,35.56 v74.18,36.83 | v77.68,37.47 77.68,46.04 77.04,46.67 77.04,51.44 75.14,53.34 v75.14,59.37 | v57.67,60.64 52.91,55.88 v52.91,49.21
  Bottom 0.254: v19.89,48.26 v38.62,48.26 51.96,48.26 v52.91,49.21 | FLASH0.4 53.55,34.61 v39.89,34.61 | v74.18,36.83 74.82,37.47 v77.68,37.47 | v75.14,59.37 73.87,60.64 v57.67,60.64
A13  (via drill 0.3)
  Top 0.254: v66.88,32.7 65.29,31.11 65.29,29.53 64.34,28.57 62.75,28.57 FLASH0.28 60.21,29.85 v57.04,26.67 | v69.74,32.7 70.69,33.66 71.64,33.66 72.28,33.02 72.28,32.07 73.23,31.11 74.18,31.11 v74.82,30.48 | v17.99,57.47 16.08,55.56 16.08,41.59 17.67,40 17.67,33.34 17.03,32.7 17.03,29.21 15.76,27.94 PLA.26 | U$2.TOP23 18.62,6.03 18.94,9.84 18.94,11.43 v15.13,15.24 | v13.54,15.88 11,18.41 7.83,18.41 6.87,19.37 6.87,25.08 7.83,26.04 10.68,26.04 v11.32,26.67 | v51.01,26.04 50.05,25.08 50.05,23.18 49.42,22.54 49.42,16.03 46.72,13.34 v45.77,13.34
  Bottom 0.254: v69.74,32.7 v66.88,32.7 | v74.82,30.48 75.45,29.85 FLASH1.28 | SRAM.28 19.57,57.47 v17.99,57.47 | v15.13,15.24 14.49,15.88 v13.54,15.88 12.59,14.92 12.59,13.65 12.91,13.34 v45.77,13.34 | v11.32,26.67 11.95,27.3 PLA.26 | v57.04,26.67 56.4,26.04 v51.01,26.04
A14  (via drill 0.3)
  Top 0.254: v58.31,45.72 IC4.2 | FLASH0.29 65.29,33.66 v65.29,34.92 | v64.02,38.73 v64.02,34.92
  Bottom 0.254: SRAM.3 18.62,46.36 50.37,46.36 50.69,46.04 57.99,46.04 v58.31,45.72 72.91,45.72 74.18,44.45 81.8,44.45 86.88,39.37 86.88,35.56 FLASH1.29 | v64.02,34.92 v65.29,34.92 | v64.02,38.73 63.71,39.05 59.9,39.05 IC4.2
A15  (via drill 0.3)
  Top 0.254: v73.23,38.73 74.82,37.15 74.82,33.66 FLASH1.3 | v44.34,55.88 46.56,53.66 46.56,40.32 v47.83,39.05 | v52.91,37.47 55.13,35.24 55.13,33.66 FLASH0.3 | IC4.5 65.29,40 v65.29,36.19
  Bottom 0.254: IC4.5 67.83,38.73 v73.23,38.73 | SRAM.31 14.49,59.05 17.67,55.88 v44.34,55.88 | v47.83,39.05 49.42,37.47 v52.91,37.47 | v65.29,36.19 61.17,36.19 60.21,35.24 60.21,34.29 59.9,34.29 59.26,33.66 58.63,33.66 57.36,32.39 FLASH0.3
A16  (via drill 0.3)
  Top 0.254: IC4.6 68.79,40.32 v68.79,37.47 | v14.49,37.78 SRAM.2
  Bottom 0.254: FLASH1.2 74.82,36.19 70.06,36.19 v68.79,37.47 68.15,36.83 58.31,36.83 FLASH0.2 55.13,36.19 53.55,36.19 52.59,35.24 29.42,35.24 27.83,36.83 15.45,36.83 v14.49,37.78
A17  (via drill 0.3)
  Top 0.254: SRAM.1 11.32,44.13 v11.32,38.73 | v61.48,38.1 FLASH0.30
  Bottom 0.254: v11.32,38.73 11.64,38.42 14.81,38.42 15.76,37.47 27.83,37.47 29.42,35.88 51.64,35.88 52.59,36.83 54.82,36.83 56.09,38.1 v61.48,38.1 73.55,38.1 75.77,40.32 | 75.77,40.32 FLASH1.30 | 75.77,40.32 IC4.9
A18  (via drill 0.3)
  Top 0.254: IC4.12 76.41,47.94 76.41,42.23 77.04,41.59 77.04,35.56 77.36,35.24 77.36,34.61 78.63,33.34 FLASH1.1 | v52.91,47.62 55.13,45.4 v55.13,44.45 | v59.58,43.81 59.9,43.5 59.9,35.56 60.21,35.24 60.21,33.66 FLASH0.1
  Bottom 0.254: JP1.1 11.32,47.94 19.26,47.94 19.57,47.62 v52.91,47.62 | v55.13,44.45 55.77,43.81 v59.58,43.81 | FLASH1.1 77.99,33.02 77.04,33.02 76.41,33.66 60.21,33.66 FLASH0.1
A19  (via drill 0.3)
  Top 0.254: IC4.15 69.42,47.31 v69.42,41.91 | v70.06,35.56 v70.06,39.37 | v63.39,34.29 63.39,38.73 61.8,40.32 v61.8,42.86 | v18.94,39.37 18.3,38.73 PLA.29
  Bottom 0.254: v69.42,41.91 69.42,40 v70.06,39.37 | v70.06,35.56 68.79,34.29 v63.39,34.29 | v61.8,42.86 61.48,43.18 44.97,43.18 44.66,42.86 27.83,42.86 27.51,42.55 26.88,42.55 25.61,41.28 20.84,41.28 v18.94,39.37
CS2  (via drill 0.3)
  Top 0.254: SRAM.30 13.54,56.52 v13.54,47.31
  Bottom 0.254: v13.54,47.31 11.64,47.31 7.51,43.18 JP1.2
D0  (via drill 0.3)
  Top 0.254: v62.75,35.56 62.75,38.73 IC4.3 60.85,43.5 59.9,44.45 59.9,48.58 58.63,49.85 57.99,49.85 57.04,48.89 57.04,47.62 56.09,46.67 55.45,46.67 54.82,47.31 54.82,52.07 v53.55,53.34 | v69.1,35.56 69.1,23.81 70.37,22.54 | 70.37,22.54 70.69,22.22 FLASH1.13 70.37,22.54 | SRAM.13 43.07,45.4 v43.07,51.44 | v51.32,16.51 FLASH0.13 | 70.37,22.54 68.47,20.64 68.47,16.19 v68.15,15.88 68.15,12.06 67.2,11.27 67.2,10 67.52,6.03 U$2.TOP4
  Bottom 0.254: v69.1,35.56 v62.75,35.56 | v43.07,51.44 50.37,51.44 52.28,53.34 v53.55,53.34 | v51.32,16.51 51.96,15.88 v68.15,15.88
D1  (via drill 0.3)
  Top 0.254: SRAM.14 45.29,44.45 v45.29,42.55 44.66,41.91 44.66,26.99 45.93,25.72 v45.93,19.05 | U$2.TOP5 v64.66,18.41
  Bottom 0.254: v45.29,42.55 61.17,42.55 63.07,40.64 IC4.4 | 54.5,19.05 55.13,18.41 v64.66,18.41 71.01,18.41 72.28,19.68 FLASH1.14 | 54.5,19.05 FLASH0.14 | 54.5,19.05 v45.93,19.05
D2  (via drill 0.3)
  Top 0.254: 70.06,40.64 69.42,40 69.42,36.83 68.47,35.88 v68.47,22.86 | 70.06,40.64 IC4.7 | SRAM.15 47.83,44.45 v47.83,40.96 | 57.04,35.88 57.67,35.24 57.67,31.11 56.4,29.85 56.4,24.77 55.77,24.13 | 57.04,35.88 v53.23,39.69 | FLASH0.15 55.77,24.13 | v70.06,44.45 70.06,40.64 | v57.67,44.45 57.04,43.81 57.04,35.88 | U$2.TOP6 61.8,6.03 62.12,10.48 62.12,13.02 60.21,14.92 60.21,22.54 58.63,24.13 55.77,24.13
  Bottom 0.254: v68.47,22.86 70.37,20.95 72.28,20.95 FLASH1.15 | v47.83,40.96 49.1,39.69 v53.23,39.69 | v57.67,44.45 v70.06,44.45
D3  (via drill 0.3)
  Top 0.254: SRAM.17 50.37,59.69 50.37,53.34 52.28,51.44 v52.28,45.4 | v72.6,45.08 73.55,44.13 IC4.8 | FLASH0.17 57.67,20.95 57.67,13.02 57.36,12.7 v57.36,12.38 | U$2.TOP7 v59.58,12.38 | FLASH1.17 74.82,20.95 74.82,19.37 70.37,14.92 v70.37,12.38 | v67.52,12.38 v67.52,45.08
  Bottom 0.254: v52.28,45.4 52.59,45.08 v67.52,45.08 v72.6,45.08 | v57.36,12.38 v59.58,12.38 v67.52,12.38 v70.37,12.38
D4  (via drill 0.3)
  Top 0.254: FLASH0.18 58.31,19.05 58.31,12.38 57.04,11.11 U$2.TOP8 | v76.41,36.19 75.14,37.47 75.14,46.67 IC4.13 72.6,49.21 72.6,51.75 v69.42,54.93 | v77.36,33.66 77.36,21.91 78.63,20.64 FLASH1.18 | SRAM.18 49.42,58.1 v49.42,54.61
  Bottom 0.254: v76.41,36.19 77.36,35.24 v77.36,33.66 | v49.42,54.61 54.5,54.61 54.82,54.93 v69.42,54.93 | FLASH0.18 59.58,20.32 60.53,20.32 61.17,20.95 64.66,20.95 65.93,19.68 71.64,19.68 72.91,20.95 76.41,20.95 77.68,19.68 FLASH1.18
D5  (via drill 0.3)
  Top 0.254: v78.95,46.36 79.9,45.4 79.9,24.13 78.63,22.86 FLASH1.19 | SRAM.19 46.88,58.1 v46.88,55.88 | U$2.TOP9 54.5,18.73 55.13,19.37 v55.13,22.54
  Bottom 0.254: IC4.14 72.6,46.67 73.23,46.67 73.55,46.36 v78.95,46.36 79.58,46.99 79.58,53.97 78.63,54.93 77.36,54.93 76.72,55.56 54.82,55.56 54.5,55.88 v46.88,55.88 | 60.21,23.5 FLASH0.19 | 60.21,23.5 77.36,23.5 FLASH1.19 | v55.13,22.54 56.09,23.5 60.21,23.5
D6  (via drill 0.3)
  Top 0.254: v45.29,50.17 43.7,51.75 43.7,58.74 SRAM.20 | FLASH0.20 62.12,19.05 v62.12,16.51 | U$2.TOP10 52.28,6.03 51.96,10.16 51.96,15.24 52.28,15.56 v52.28,16.51 | IC4.17 66.25,45.4 v66.25,43.81 | v81.49,43.81 82.44,42.86 82.44,20.95 FLASH1.20
  Bottom 0.254: IC4.17 61.8,49.85 61.8,52.7 61.48,53.02 54.18,53.02 52.91,51.75 51.32,51.75 49.74,50.17 v45.29,50.17 | FLASH1.20 85.3,19.68 85.61,19.37 85.61,18.73 84.66,17.78 76.41,17.78 75.77,17.14 63.71,17.14 63.07,16.51 v62.12,16.51 v52.28,16.51 | v81.49,43.81 v66.25,43.81
D7  (via drill 0.3)
  Top 0.254: v39.89,48.89 SRAM.21 | v69.1,20.32 70.37,19.05 70.37,18.41 | U$2.TOP3 69.74,15.24 70.37,15.88 70.37,18.41 | v77.36,20.95 77.36,19.37 76.41,18.41 v74.82,18.41 | 70.37,18.41 v71.96,18.41 | IC4.18 61.8,47.31 v61.8,43.81 | v86.25,38.73 86.88,38.1 86.88,20 85.3,18.41 84.66,18.41 83.71,19.37 FLASH1.21
  Bottom 0.254: v39.89,48.89 51.64,48.89 52.59,49.85 59.26,49.85 IC4.18 | FLASH0.21 65.93,20.32 v69.1,20.32 | FLASH1.21 82.44,20.95 v77.36,20.95 | v71.96,18.41 v74.82,18.41 | v61.8,43.81 62.44,43.18 81.8,43.18 v86.25,38.73
GND  (via drill 0.3)
  Top 0.356: C2.2 13.22,39.05 v13.22,36.83 | v8.78,43.5 C5.2 | PLA.16 9.41,20.95 9.41,23.5 PLA.12 | C1.- 26.56,25.4 v26.56,21.59 | v50.05,52.07 SRAM.16 | IC2.7 74.5,52.39 74.5,59.69 74.82,60.01 76.41,60.01 76.72,59.69 R2.2 76.72,52.7 77.68,51.75 77.68,46.99 78.31,46.36 78.31,40.96 IC4.10 | IC1.7 46.56,18.73 v46.56,21.59 46.56,30.8 IC8.8 46.24,33.34 48.47,35.56 48.47,39.69 49.42,40.64 C3.- | v56.4,17.14 FLASH0.16 56.4,12.06 v56.72,11.75 | C4.2 84.98,38.1 v84.98,19.05
  Bottom 0.356: v13.22,36.83 11.95,35.56 11.95,33.66 4.97,33.66 | 4.97,33.66 2.43,31.11 2.43,26.99 3.38,26.04 6.87,26.04 6.87,24.77 PLA.12 | v8.78,43.5 8.78,36.19 7.51,36.19 4.97,33.66 | PLA.16 11.95,19.68 11.95,20.95 18.94,20.95 19.57,21.59 v26.56,21.59 v46.56,21.59 | v50.05,52.07 51.96,53.97 C6.2 55.45,54.29 78.31,54.29 78.63,53.97 78.63,51.44 IC2.7 | C4.2 82.76,39.37 82.44,39.69 82.44,40.64 IC4.10 | 57.04,11.75 U$2.BTM8 | 59.58,11.75 57.04,11.75 | U$2.BTM7 59.58,11.75 | 62.12,11.75 U$2.BTM6 | 59.58,11.75 62.12,11.75 | 64.66,11.75 U$2.BTM5 | 62.12,11.75 64.66,11.75 | 67.2,11.75 U$2.BTM4 | 64.66,11.75 67.2,11.75 | 69.74,11.75 U$2.BTM3 | 67.2,11.75 69.74,11.75 | 72.28,11.75 U$2.BTM2 | 69.74,11.75 72.28,11.75 | U$2.BTM1 74.82,11.75 72.28,11.75 | IC1.7 44.97,16.99 45.13,16.83 47.83,16.83 48.15,17.14 v56.4,17.14 62.75,17.14 63.39,17.78 75.45,17.78 76.09,18.41 | 76.09,18.41 FLASH1.16 | v56.72,11.75 57.04,11.75 | v84.98,19.05 84.34,18.41 76.09,18.41
  pour Bottom: -0.59,63.5 -0.59,14.13 4.49,11.43 86.73,11.75 89.58,16.51 89.58,61.44 88.15,64.14 0.05,64.14
M0  (via drill 0.3)
  Top 0.254: IC1.3 33.54,18.41 v33.54,23.5 | v24.65,23.18 24.34,23.5 v24.34,26.35 | v15.45,28.57 13.86,30.16 v13.86,30.48
  Bottom 0.254: v33.54,23.5 33.23,23.18 v24.65,23.18 | v24.34,26.35 23.38,27.3 19.89,27.3 18.62,28.57 v15.45,28.57 | v13.86,30.48 9.41,30.48 8.78,31.11 6.87,31.11 PLA.7
M1  (via drill 0.3)
  Top 0.254: v34.18,18.73 v34.18,22.86 | v6.87,17.14 3.7,20.32 3.7,32.07 5.29,33.66 6.87,33.66 PLA.6
  Bottom 0.254: IC1.11 35.45,22.86 v34.18,22.86 | v34.18,18.73 26.56,18.73 24.34,16.51 12.27,16.51 11.64,17.14 v6.87,17.14
M2  (via drill 0.3)
  Top 0.254: IC1.6 42.12,16.83 v42.12,12.38 | v21.8,12.7 21.48,13.02 v21.48,13.97 | v13.22,13.97 12.59,14.61 12.59,16.19 11,17.78 6.87,17.78 4.33,20.32 4.33,31.11 PLA.5
  Bottom 0.254: v42.12,12.38 26.56,12.38 26.24,12.7 v21.8,12.7 | v13.22,13.97 v21.48,13.97
M3  (via drill 0.3)
  Top 0.254: IC1.8 44.02,23.81 v44.02,14.92 | v17.67,15.24 17.67,21.27 17.03,21.91 17.03,22.54 16.08,23.5 15.45,23.5 14.49,24.45 14.49,25.08 15.45,26.04 16.08,26.04 17.03,26.99 17.03,28.57 PLA.27
  Bottom 0.254: v44.02,14.92 43.7,14.61 19.26,14.61 18.62,15.24 v17.67,15.24
N$1  (via drill 0.3)
  Top 0.254: D2.C 23.07,44.13 23.07,57.15 20.53,59.69 20.53,60.96 19.89,61.59 13.54,61.59 12.91,60.96 12.91,42.55 11.95,41.59 v11.95,28.57 | v13.86,27.94 13.86,23.18 14.49,22.54 14.49,20.95 PLA.20
  Bottom 0.254: v11.95,28.57 12.59,27.94 v13.86,27.94
N$3
  Bottom 0.254: LED1.K 79.58,57.78 83.07,57.78 R2.1
N$6
  Bottom 0.254: IC8.13 37.67,40.32 44.66,40.32 IC8.9
N$7
  Top 0.254: C7.2 IC8.14
N$8
  Top 0.254: IC8.6 C8.2
N$9
  Top 0.254: C8.1 IC8.7
  Bottom 0.254: R4.2 39.58,28.89 41.8,28.89 42.75,27.94 C8.1
N$11
  Top 0.254: C7.1 IC8.15
  Bottom 0.254: R3.2 35.13,40.96 31.96,40.96 C7.1
RAMSEL  (via drill 0.3)
  Top 0.254: IC4.16 64.34,49.85 64.34,53.34 59.58,58.1 59.58,59.69 57.99,61.28 55.77,61.28 52.28,57.78 v52.28,55.25 | v4.65,55.25 3.06,53.66 v3.06,30.8
  Bottom 0.254: v52.28,55.25 34.18,55.25 32.91,53.97 8.78,53.97 7.51,55.25 v4.65,55.25 | v3.06,30.8 5.29,28.57 11,28.57 11.64,29.21 15.13,29.21 PLA.28
REGREL  (via drill 0.3)
  Top 0.254: IC4.19 57.99,47.94 57.99,46.36 52.59,40.96 52.59,40 52.28,39.69 51.01,39.69 50.69,40 50.69,42.23 49.1,43.81 v49.1,52.7 | v5.29,54.61 4.02,53.34 4.02,44.77 6.24,42.55 6.24,36.83 PLA.4
  Bottom 0.254: v49.1,52.7 48.47,53.34 8.78,53.34 7.51,54.61 v5.29,54.61
RESENA  (via drill 0.3)
  Top 0.254: IC2.6 64.98,57.47 62.75,57.47 62.12,58.1 62.12,59.69 59.9,61.91 34.18,61.91 33.23,60.96 v33.23,55.25 | v9.73,54.61 9.41,54.29 9.41,43.18 8.78,42.55 8.78,35.88 9.41,35.24 9.41,33.66 PLA.3
  Bottom 0.254: v33.23,55.25 32.59,54.61 v9.73,54.61
VCC  (via drill 0.3)
  Top 0.356: 56.09,56.52 57.04,56.52 58.31,57.78 IC2.14 | 56.09,56.52 C6.1 | IC4.20 56.09,48.58 56.09,56.52 | v51.64,46.67 C3.+ | FLASH0.32 59.26,35.24 59.26,43.18 58.94,43.5 v58.94,46.67 | C4.1 80.53,40 80.53,50.17 77.68,53.02 LED1.A | PLA.1 PLA.32 12.59,35.56 12.59,40.96 C2.1 | PLA.30 PLA.31 | C5.1 10.37,57.47 10.37,41.91 JP1.3 | IC1.14 29.73,27.62 30.69,28.57 | 30.69,28.57 31,28.89 IC8.2 | R4.1 30.69,28.26 30.69,28.57 | R3.1 IC8.10 43.7,34.29 v44.02,33.97 | RN1.1 24.02,16.83 25.92,16.83 | 25.92,16.83 25.92,24.77 25.61,25.08 25.61,26.35 26.24,26.99 27.51,26.99 28.15,27.62 28.15,29.21 27.51,29.85 27.51,32.7 28.46,33.66 | IC8.16 28.46,33.66 | 28.46,33.66 v28.78,33.34 | R1.2 v25.61,34.92 | v26.24,11.75 25.92,12.06 25.92,16.83
  Bottom 0.356: IC4.20 54.18,46.67 | v51.64,46.67 54.18,46.67 | 54.18,46.67 v58.94,46.67 64.02,46.67 64.34,46.99 64.34,49.53 64.02,49.85 62.75,49.85 62.44,50.17 62.44,52.7 62.75,53.02 67.52,53.02 | 67.52,53.02 68.15,53.66 77.36,53.66 LED1.A | 67.52,53.02 IC2.4 | FLASH1.32 79.9,33.66 81.8,33.66 82.44,34.29 82.44,38.1 C4.1 | 34.18,11.75 U$2.BTM17 | 36.72,11.75 34.18,11.75 | U$2.BTM16 36.72,11.75 | 39.26,11.75 U$2.BTM15 | 36.72,11.75 39.26,11.75 | 41.8,11.75 U$2.BTM14 | 39.26,11.75 41.8,11.75 | 44.34,11.75 U$2.BTM13 | 41.8,11.75 44.34,11.75 | 46.88,11.75 U$2.BTM12 | 44.34,11.75 46.88,11.75 | 49.42,11.75 U$2.BTM11 | 46.88,11.75 49.42,11.75 | U$2.BTM10 51.96,11.75 49.42,11.75 | PLA.31 PLA.1 | C5.1 9.73,60.01 SRAM.32 | C2.1 13.22,41.59 JP1.3 | IC8.3 IC8.2 v28.78,33.34 | IC8.10 IC8.11 39.58,37.15 32.91,37.15 32.27,37.78 32.27,39.69 31.64,40.32 29.73,40.32 28.15,41.91 27.51,41.91 27.19,41.59 27.19,38.73 | IC8.16 27.19,38.73 | 27.19,38.73 R1.2 | v25.61,34.92 PLA.30 | v26.24,11.75 34.18,11.75 | FLASH0.32 57.67,33.66 47.83,33.66 47.51,33.97 v44.02,33.97

### Text on the board
tPlace: Top | Felül | HM628128 / AS6C1008 / HM628512 / AS6C4008 | AS6C62256 / HM62256B / AS6C6264 / HM6264 | Optional | SRAM size | Videoton TV Computer / Multicart v2.2 - 2019 | 512kB | Other | Optional
bPlace: Bottom | Alul | KZ | VS